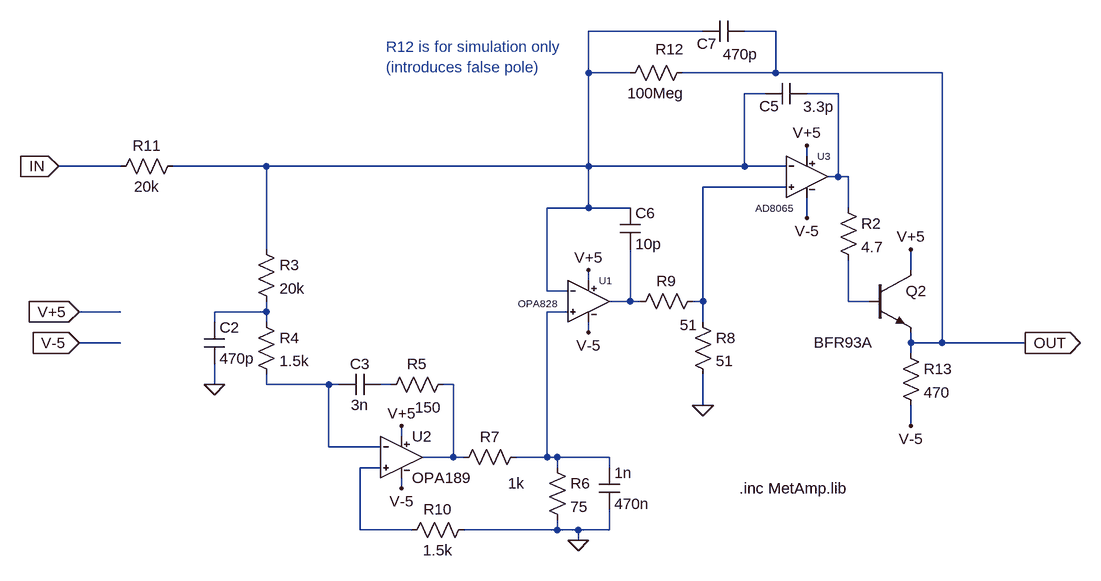
[diagram p0: schematic 3_amp_int_drafta_mod.asc]
3_amp_int_drafta_mod.asc, the LTspice schematic file:
Version 4
SHEET 1 1476 680
WIRE 464 -256 288 -256
WIRE 576 -256 528 -256
WIRE 288 -192 288 -256
WIRE 352 -192 288 -192
WIRE 576 -192 576 -256
WIRE 576 -192 432 -192
WIRE 832 -192 576 -192
WIRE 560 -160 528 -160
WIRE 672 -160 624 -160
WIRE 624 -64 624 -80
WIRE -432 -48 -528 -48
WIRE -208 -48 -352 -48
WIRE 288 -48 288 -192
WIRE 288 -48 -208 -48
WIRE 528 -48 528 -160
WIRE 528 -48 288 -48
WIRE 592 -48 528 -48
WIRE 672 -32 672 -160
WIRE 672 -32 656 -32
WIRE 688 -32 672 -32
WIRE 592 -16 464 -16
WIRE 288 16 288 -48
WIRE 288 16 224 16
WIRE 352 16 288 16
WIRE 688 16 688 -32
WIRE 624 32 624 0
WIRE -208 80 -208 -48
WIRE 784 112 784 80
WIRE 288 128 288 112
WIRE 224 144 224 16
WIRE 256 144 224 144
WIRE 352 160 352 80
WIRE 352 160 320 160
WIRE 368 160 352 160
WIRE 464 160 464 -16
WIRE 464 160 448 160
WIRE 688 160 688 96
WIRE 720 160 688 160
WIRE -432 176 -496 176
WIRE -208 176 -208 160
WIRE -208 176 -288 176
WIRE 256 176 224 176
WIRE -288 192 -288 176
WIRE -208 192 -208 176
WIRE 464 192 464 160
WIRE 288 208 288 192
WIRE -432 224 -496 224
WIRE 784 224 784 208
WIRE 832 224 832 -192
WIRE 832 224 784 224
WIRE 960 224 832 224
WIRE 784 240 784 224
WIRE -288 288 -288 256
WIRE -208 288 -208 272
WIRE -112 288 -208 288
WIRE -96 288 -112 288
WIRE -16 288 -32 288
WIRE 80 288 64 288
WIRE 464 320 464 272
WIRE 784 352 784 320
WIRE 0 368 0 352
WIRE -112 384 -112 288
WIRE -32 384 -112 384
WIRE 80 400 80 288
WIRE 80 400 32 400
WIRE 96 400 80 400
WIRE 224 400 224 176
WIRE 224 400 176 400
WIRE 240 400 224 400
WIRE 320 400 240 400
WIRE -32 416 -64 416
WIRE 240 416 240 400
WIRE 320 416 320 400
WIRE 0 448 0 432
WIRE -64 512 -64 416
WIRE 16 512 -64 512
WIRE 240 512 240 496
WIRE 240 512 96 512
WIRE 272 512 240 512
WIRE 320 512 320 480
WIRE 320 512 272 512
WIRE 272 528 272 512
FLAG 464 320 0
FLAG 272 528 0
FLAG 624 -80 V+5
FLAG 624 32 V-5
FLAG 0 352 V+5
FLAG 288 112 V+5
FLAG 288 208 V-5
FLAG 0 448 V-5
FLAG -288 288 0
FLAG 784 80 V+5
FLAG 784 352 V-5
FLAG -528 -48 IN
IOPIN -528 -48 In
FLAG 960 224 OUT
IOPIN 960 224 Out
FLAG -496 176 V+5
IOPIN -496 176 In
FLAG -496 224 V-5
IOPIN -496 224 In
SYMBOL res -224 64 R0
SYMATTR InstName R3
SYMATTR Value 20k
SYMBOL res -224 176 R0
SYMATTR InstName R4
SYMATTR Value 1.5k
SYMBOL res 80 272 R90
WINDOW 0 0 56 VBottom 2
WINDOW 3 36 39 VTop 2
SYMATTR InstName R5
SYMATTR Value 150
SYMBOL cap -32 272 R90
WINDOW 0 0 32 VBottom 2
WINDOW 3 32 32 VTop 2
SYMATTR InstName C3
SYMATTR Value 3n
SYMATTR Value2 IC=0
SYMBOL res 224 400 R0
SYMATTR InstName R6
SYMATTR Value 75
SYMBOL cap 304 416 R0
SYMATTR InstName 1n
SYMATTR Value 470n
SYMBOL res 192 384 R90
WINDOW 0 0 56 VBottom 2
WINDOW 3 41 15 VTop 2
SYMATTR InstName R7
SYMATTR Value 1k
SYMBOL res 448 176 R0
SYMATTR InstName R8
SYMATTR Value 51
SYMBOL res 464 144 R90
WINDOW 0 0 56 VBottom 2
WINDOW 3 37 22 VTop 2
SYMATTR InstName R9
SYMATTR Value 51
SYMBOL cap 624 -176 R90
WINDOW 0 51 58 VBottom 2
WINDOW 3 21 -18 VTop 2
SYMATTR InstName C5
SYMATTR Value 3.3p
SYMBOL res 112 496 R90
WINDOW 0 0 56 VBottom 2
WINDOW 3 32 56 VTop 2
SYMATTR InstName R10
SYMATTR Value 1.5k
SYMBOL res -336 -64 R90
WINDOW 0 0 56 VBottom 2
WINDOW 3 32 56 VTop 2
SYMATTR InstName R11
SYMATTR Value 20k
SYMBOL res 448 -208 R90
WINDOW 0 -5 35 VBottom 2
WINDOW 3 32 56 VTop 2
SYMATTR InstName R12
SYMATTR Value 100Meg
SYMBOL cap -304 192 R0
SYMATTR InstName C2
SYMATTR Value 470p
SYMBOL res 672 0 R0
SYMATTR InstName R2
SYMATTR Value 4.7
SYMBOL npn 720 112 R0
WINDOW 3 -85 111 Left 2
SYMATTR Value BFR93A
SYMATTR InstName Q2
SYMBOL res 768 224 R0
SYMATTR InstName R13
SYMATTR Value 470
SYMBOL cap 528 -272 R90
WINDOW 0 51 58 VBottom 2
WINDOW 3 36 6 VTop 2
SYMATTR InstName C7
SYMATTR Value 470p
SYMATTR Value2 IC=0
SYMBOL cap 336 16 R0
SYMATTR InstName C6
SYMATTR Value 10p
SYMBOL OPA189 0 336 R0
SYMATTR InstName U2
SYMBOL AD8065 624 -96 R0
WINDOW 3 -79 112 Left 1
SYMATTR InstName U3
SYMBOL OPA828 288 96 R0
WINDOW 3 -109 67 Left 1
SYMATTR InstName U1
TEXT -24 -232 Left 2 ;R12 is for simulation only\n(introduces false pole)
TEXT 520 448 Left 2 !.inc MetAmp.lib

The netlist it stands for:
* 3_amp_int_drafta_mod.asc
R3 N001 N006 20k
R4 N006 N008 1.5k
R5 N010 N009 150
C3 N009 N008 3n IC=0
R6 N007 0 75
C§1n N007 0 470n
R7 N007 N010 1k
R8 N003 0 51
R9 N003 N004 51
C5 N002 N001 3.3p
R10 0 N011 1.5k
R11 N001 IN 20k
R12 OUT N001 100Meg
C2 N006 0 470p
R2 N002 N005 4.7
Q2 V+5 N005 OUT 0 BFR93A
R13 OUT V-5 470
C7 OUT N001 470p IC=0
C6 N001 N004 10p
XU2 N011 N008 V+5 V-5 N010 OPA189  ; pins In+ In- V+ V- OUT
XU3 N003 N001 V+5 V-5 N002 AD8065  ; pins In+ In- V+ V- OUT
XU1 N007 N001 V+5 V-5 N004 OPAx828  ; pins In+ In- V+ V- OUT
.model NPN NPN
.model PNP PNP
.lib standard.bjt
* R12 is for simulation only
* (introduces false pole)
.inc MetAmp.lib
.lib MetAmp.lib
.backanno
.end